# Altium schematic sheet Schema_complet.SchDoc
size A2
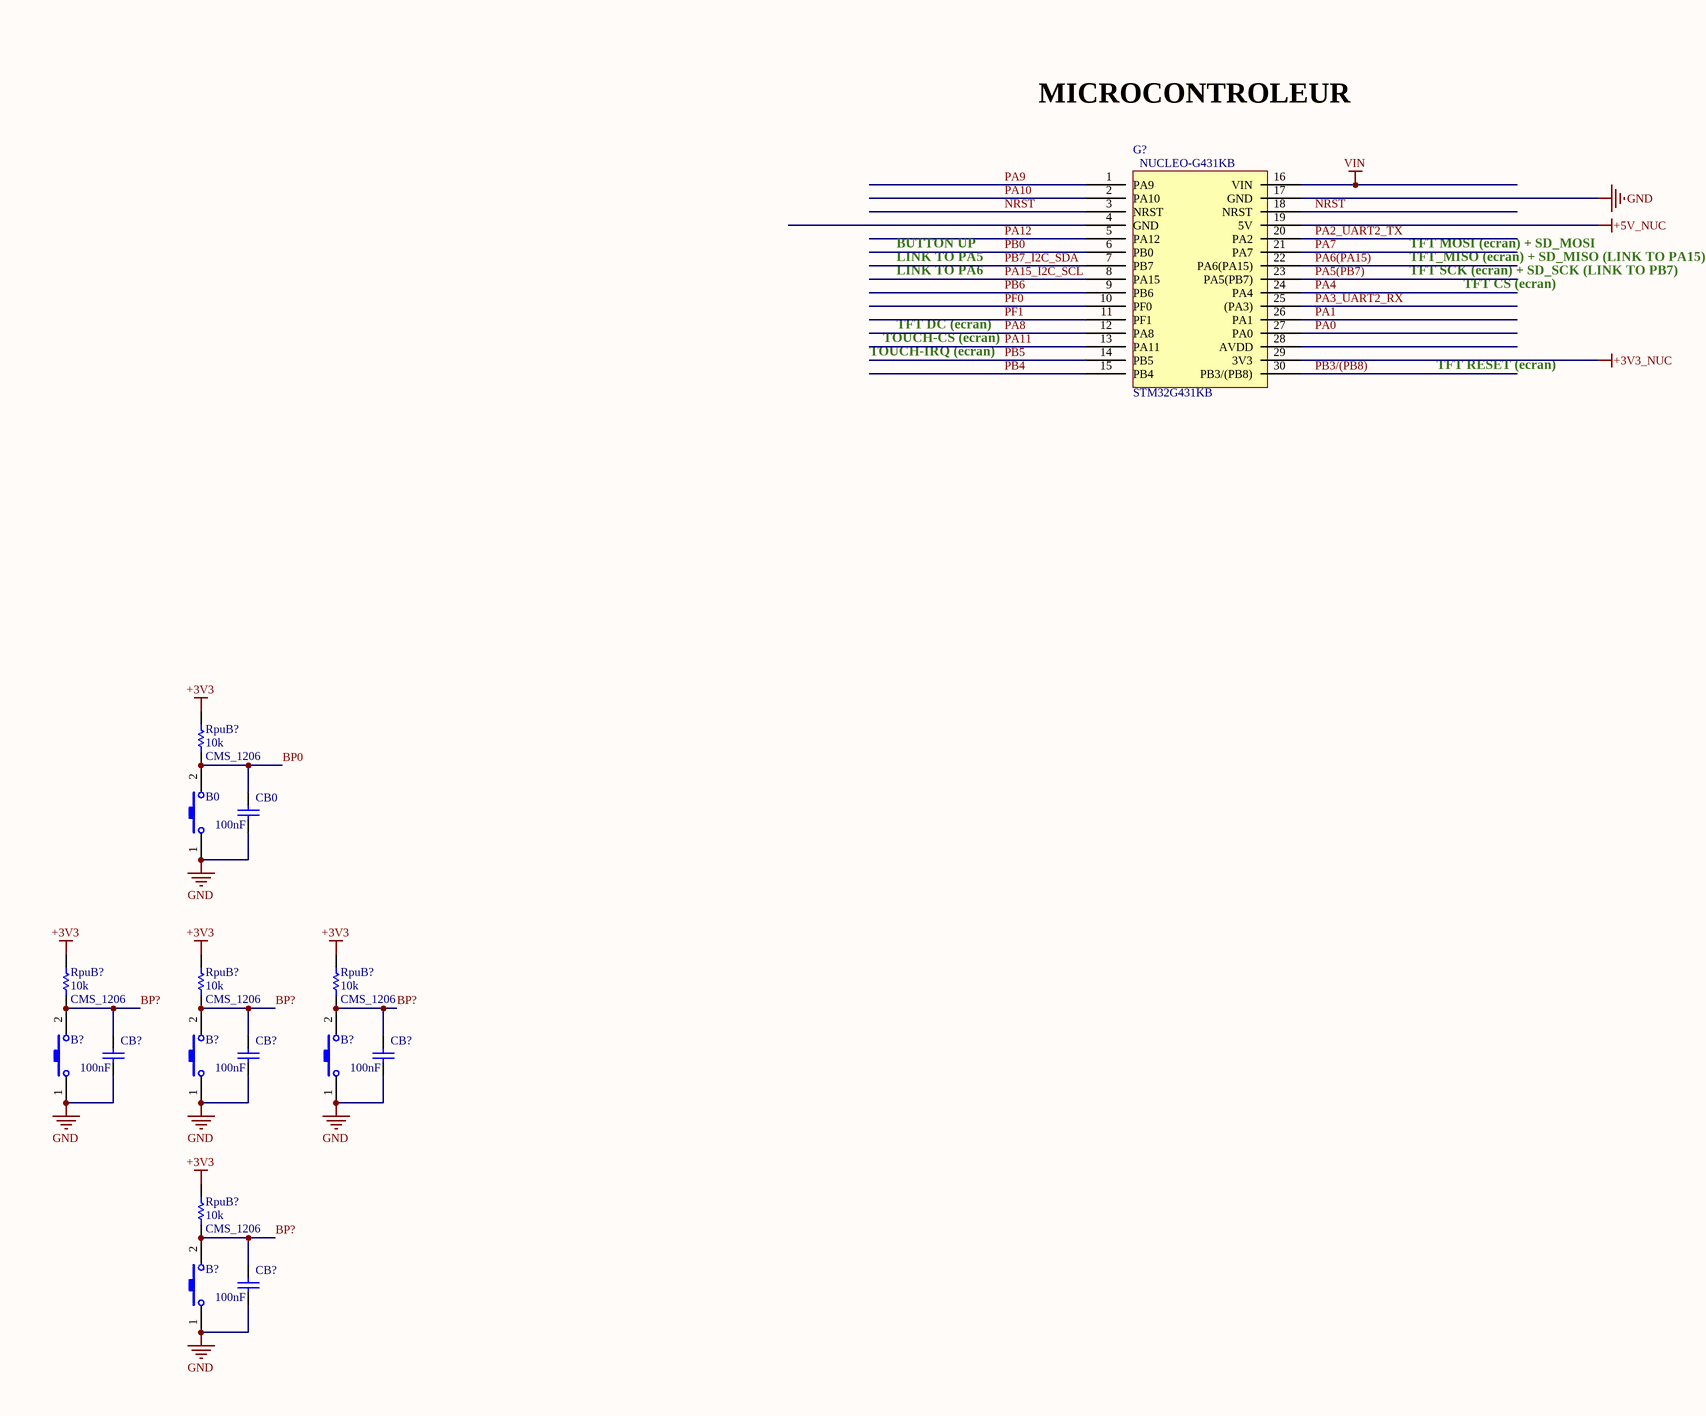
[diagram p0: Schema_complet.SchDoc, left]
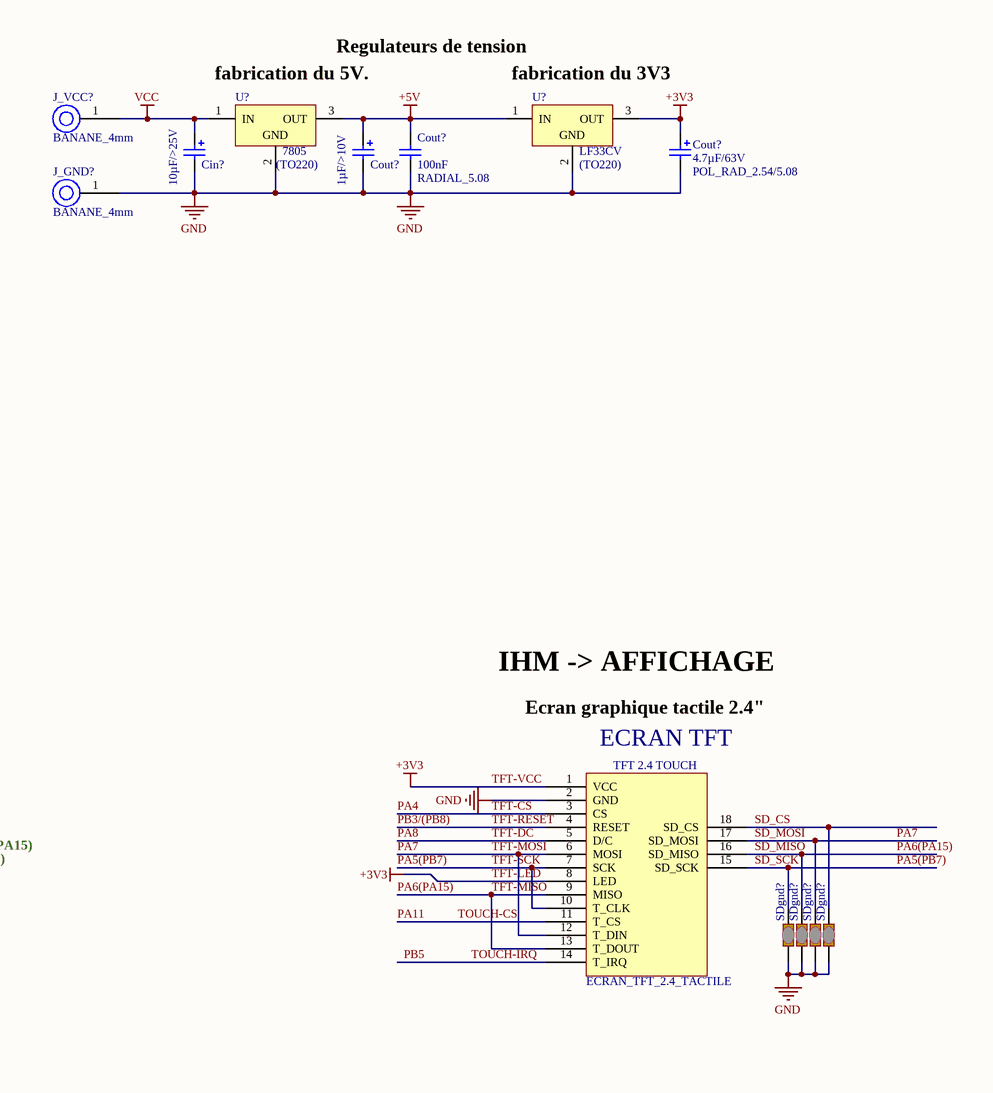
[diagram p1: Schema_complet.SchDoc, right]

## Parts
(Parts that share a designator on the sheet are numbered #1, #2 ... from top to bottom, then left to right.)
B0  BOUTON_POUSSOIR_MINIATURE_TRAVERSANT  [BOUTON_POUSSE_PLAT_6x6]  (value not drawn)
B?#1  BOUTON_POUSSOIR_MINIATURE_TRAVERSANT  [BOUTON_POUSSE_PLAT_6x6]  (value not drawn)
B?#2  BOUTON_POUSSOIR_MINIATURE_TRAVERSANT  [BOUTON_POUSSE_PLAT_6x6]  (value not drawn)
B?#3  BOUTON_POUSSOIR_MINIATURE_TRAVERSANT  [BOUTON_POUSSE_PLAT_6x6]  (value not drawn)
B?#4  BOUTON_POUSSOIR_MINIATURE_TRAVERSANT  [BOUTON_POUSSE_PLAT_6x6]  (value not drawn)
CB0  value 100nF  [C0805_N]  (hidden comment: Condensateur 0805)
CB?#1  value 100nF  [C0805_N]  (hidden comment: Condensateur 0805)
CB?#2  value 100nF  [C0805_N]  (hidden comment: Condensateur 0805)
CB?#3  value 100nF  [C0805_N]  (hidden comment: Condensateur 0805)
CB?#4  value 100nF  [C0805_N]  (hidden comment: Condensateur 0805)
Cin?  value 10µF/>25V  [CONDENSATEUR_POLARISE_ELECTROLYTIQUE_RADIAL_2.0/5.08]  (hidden comment: CONDENSATEUR_POL_ELECTROLY_RAD_2.0/5.08)
Cout?#1  value 1µF/>10V  [CONDENSATEUR_POLARISE_ELECTROLYTIQUE_RADIAL_2.0/5.08]  (hidden comment: CONDENSATEUR_POL_ELECTROLY_RAD_2.0/5.08)
Cout?#2  value 4.7µF/63V  Type: POL_RAD_2.54/5.08  [CONDENSATEUR_POLARISE_ELECTROLYTIQUE_RADIAL_2.54/5.08]  (hidden comment: CONDENSATEUR_POL_ELECTROLY_RAD_2.54/5.08)
Cout?#3  value 100nF  Type: RADIAL_5.08  [CONDENSATEUR_CERAMIQUE_RADIAL_5.08]  (hidden comment: CONDENSATEUR_CER_RAD_5.08)
G?  STM32G431KB  [NUCLEO-G431KB]
J_GND?  Type: BANANE_4mm  [DOUILLE_BANANE_4mm]  (hidden comment: DOUILLE BANANE 4mm)
J_VCC?  Type: BANANE_4mm  [DOUILLE_BANANE_4mm]  (hidden comment: DOUILLE BANANE 4mm)
RpuB?#1  value 10k  Type: CMS_1206  [RESISTANCE_CMS_1206]  (hidden comment: RESISTANCE_CMS_1206)
RpuB?#2  value 10k  Type: CMS_1206  [RESISTANCE_CMS_1206]  (hidden comment: RESISTANCE_CMS_1206)
RpuB?#3  value 10k  Type: CMS_1206  [RESISTANCE_CMS_1206]  (hidden comment: RESISTANCE_CMS_1206)
RpuB?#4  value 10k  Type: CMS_1206  [RESISTANCE_CMS_1206]  (hidden comment: RESISTANCE_CMS_1206)
RpuB?#5  value 10k  Type: CMS_1206  [RESISTANCE_CMS_1206]  (hidden comment: RESISTANCE_CMS_1206)
SDgnd?#1  Goutte Strap  [GOUTTE_Starp]  (value not drawn)
SDgnd?#2  Goutte Strap  [GOUTTE_Starp]  (value not drawn)
SDgnd?#3  Goutte Strap  [GOUTTE_Starp]  (value not drawn)
SDgnd?#4  Goutte Strap  [GOUTTE_Starp]  (value not drawn)
TFT?  ECRAN_TFT_2.4_TACTILE  [ECRAN_TFT_2.4_TACTILE]
U?#1  Type: 7805  Package: (TO220)  [REGULATEUR_TO220_78XX]  (hidden comment: REGULATEUR_TO220_78XX)
U?#2  Type: LF33CV  Package: (TO220)  [REGULATEUR_TO220_78XX]  (hidden comment: REGULATEUR_TO220_78XX)

## Nets
+3V3_NUC: G?.29(3V3)
+5V: Cout?#1.1 Cout?#3.2 U?#1.3(OUT) U?#2.1(IN)
+5V_NUC: G?.19(5V)
GND: B0.1 B?#1.1 B?#2.1 B?#3.1 B?#4.1 CB0.1 CB?#1.1 CB?#2.1 CB?#3.1 CB?#4.1 Cin?.2 Cout?#1.2 Cout?#2.2 Cout?#3.1 G?.17(GND) J_GND?.1 SDgnd?#1.1 SDgnd?#2.1 SDgnd?#3.1 SDgnd?#4.1 TFT?.2(GND) U?#1.2(GND) U?#2.2(GND)
TFT-LED: Cout?#2.1 RpuB?#1.2 RpuB?#2.2 RpuB?#3.2 RpuB?#4.2 RpuB?#5.2 TFT?.1(VCC) TFT?.8(LED) U?#2.3(OUT)  [also labelled +3V3, TFT-VCC]
VCC: Cin?.1 J_VCC?.1 U?#1.1(IN)
VIN: G?.16(VIN)
BP0: B0.2 CB0.2 RpuB?#1.1
BP?: B?#1.2 B?#2.2 B?#3.2 B?#4.2 CB?#1.2 CB?#2.2 CB?#3.2 CB?#4.2 RpuB?#2.1 RpuB?#3.1 RpuB?#4.1 RpuB?#5.1
NRST: G?.3(NRST) G?.18(NRST)
PA0: G?.27(PA0)
PA1: G?.26(PA1)
PA2_UART2_TX: G?.20(PA2)
PA3_UART2_RX: G?.25((PA3))
PA4: G?.24(PA4) TFT?.3(CS)  [also labelled TFT-CS]
PA5(PB7): G?.23(PA5(PB7)) SDgnd?#1.2 TFT?.7(SCK) TFT?.10(T_CLK) TFT?.15(SD_SCK)  [also labelled SD_SCK, TFT-SCK]
PA6(PA15): G?.22(PA6(PA15)) SDgnd?#2.2 TFT?.9(MISO) TFT?.13(T_DOUT) TFT?.16(SD_MISO)  [also labelled SD_MISO, TFT-MISO]
PA7: G?.21(PA7) SDgnd?#3.2 TFT?.6(MOSI) TFT?.12(T_DIN) TFT?.17(SD_MOSI)  [also labelled SD_MOSI, TFT-MOSI]
PA8: G?.12(PA8) TFT?.5(D/C)  [also labelled TFT-DC]
PA9: G?.1(PA9)
PA10: G?.2(PA10)
PA11: G?.13(PA11) TFT?.11(T_CS)  [also labelled TOUCH-CS]
PA12: G?.5(PA12)
PA15_I2C_SCL: G?.8(PA15)
PB0: G?.6(PB0)
PB3/(PB8): G?.30(PB3/(PB8)) TFT?.4(RESET)  [also labelled TFT-RESET]
PB4: G?.15(PB4)
PB5: G?.14(PB5) TFT?.14(T_IRQ)  [also labelled TOUCH-IRQ]
PB6: G?.9(PB6)
PB7_I2C_SDA: G?.7(PB7)
PF0: G?.10(PF0)
PF1: G?.11(PF1)
SD_CS: SDgnd?#4.2 TFT?.18(SD_CS)

Not connected (* = marked no-connect by the designer): G? 4(GND) 28(AVDD)

## Notes on the sheet
- (near U?#1) fabrication du 5V.
- Regulateurs de tension
- (near U?#2) fabrication du 3V3
- MICROCONTROLEUR
- IHM -> AFFICHAGE
- Ecran graphique tactile 2.4"
- (near TFT?) ECRAN TFT
- LINK TO PA6
- LINK TO PA5
- BUTTON UP
- TFT SCK (ecran) + SD_SCK (LINK TO PB7)
- TFT_MISO (ecran) + SD_MISO (LINK TO PA15)
- TFT MOSI (ecran) + SD_MOSI
- TFT CS (ecran)
- TOUCH-IRQ (ecran)
- TOUCH-CS (ecran)
- TFT DC (ecran)
- TFT RESET (ecran)
- (in symbol ECRAN_TFT_2.4_TACTILE) TFT 2.4 TOUCH
- (in symbol G431_Nucleo) NUCLEO-G431KB

## Library data of the parts
B0 B?#1-B?#4 = BOUTON_POUSSOIR_MINIATURE_TRAVERSANT: BOUTON POUSSOIR MINIATURE TRAVERSANT ON/OFF; Type: B_POUSS_MINI_T
CB0 CB?#1-CB?#4 = CONDENSATEUR_CER_RAD_5.08: Type: RADIAL_5.08
Cin? Cout?#1 = CONDENSATEUR_POL_ELECTROLY_RAD_2.0/5.08: CONDENSATEUR POLARISE ELECTROLYTIQUE RADIAL 2.0/5.08; Type: POL_RAD_2.0/5.08
Cout?#2 = CONDENSATEUR_POL_ELECTROLY_RAD_2.54/5.08: CONDENSATEUR POLARISE ELECTROLYTIQUE RADIAL 2.54/5.08
Cout?#3 = CONDENSATEUR_CER_RAD_5.08: CONDENSATEUR TRAVERSANT CERAMIQUE RADIAL 5.08mm
G? = G431_Nucleo: The STM32 Nucleo-32 board provides an affordable and flexible way for users to try out new concepts and build prototypes by choosing from the various combinations of performance and power consumption features, provided by the STM32 microcontroller.
J_GND? J_VCC? = DOUILLE_BANANE_4mm: DOUILLE BANANE 4 mm
RpuB?#1-RpuB?#5 = RESISTANCE_CMS_1206: RESISTANCE CMS 1206
SDgnd?#1-SDgnd?#4 = Goutte Strap: Goutte Strap_2; LatestRevisionDate: 30/01/11; Publisher: Damien Guitton
U?#1 U?#2 = REGULATEUR_TO220_78XX: REGULATEUR DE TENSION POSITIVE 78XX BOITIER TO220